# Altium schematic sheet MainBoard Pro Mini_2.SchDoc
size A4; SheetNumber: 2; SheetTotal: 2
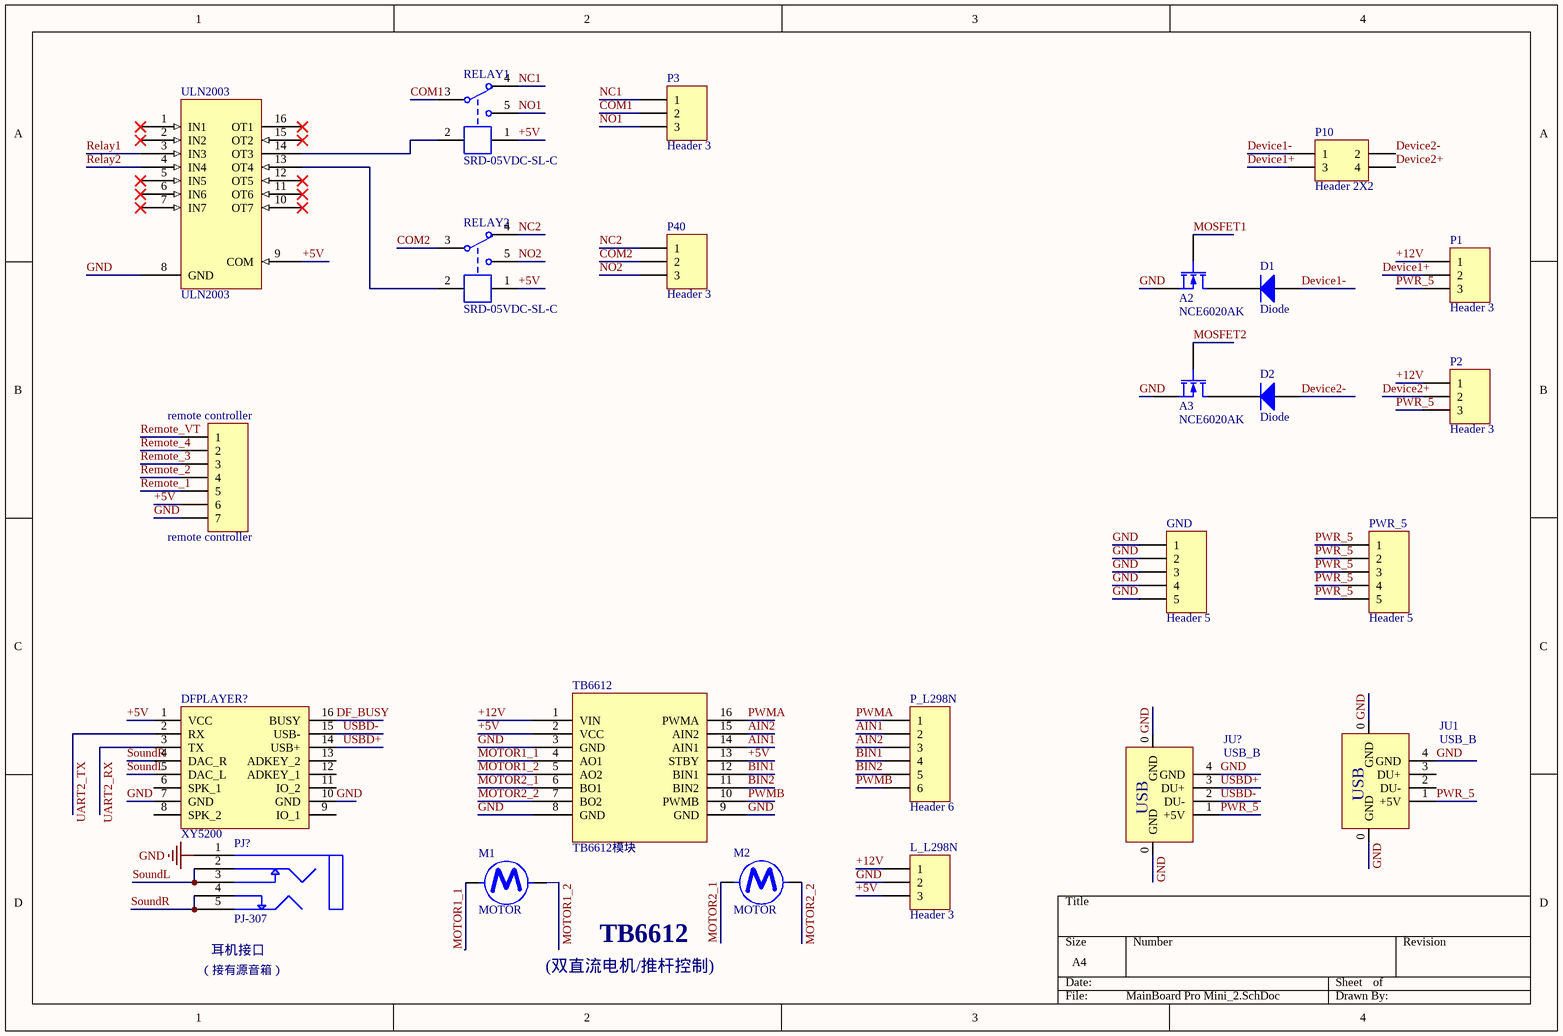
[diagram p0: MainBoard Pro Mini_2.SchDoc]

## Parts
A2  NCE6020AK  [TO252-2L]
A3  NCE6020AK  [TO252-2L]
D1  Diode  [DO-214AC]
D2  Diode  [DO-214AC]
DFPLAYER?  XY5200  [DFPlayer]
GND  Header 5  [HDR1X5]
JU1  USB_B  [USB-48204-0001]
JU?  USB_B  [USB-1734085]
L_L298N  Header 3  [PHOENIX_1715734]
M1  MOTOR  [KF2EDGK5.0-WI-2P]
M2  MOTOR  [KF2EDGK5.0-WI-2P]
P1  Header 3  [COMATEL_385.0358.1.03.400]
P2  Header 3  [COMATEL_385.0358.1.03.400]
P3  Header 3  [PHOENIX_1715734]
P10  Header 2X2  [CK-5.08-2x2]
P40  Header 3  [PHOENIX_1715734]
P_L298N  Header 6  [2-644861-6 _2.54]
PJ?  PJ-307  [PJ-307X]
PWR_5  Header 5  [HDR1X5]
RELAY1  SRD-05VDC-SL-C  [REL_FINDER_36.11]
RELAY2  SRD-05VDC-SL-C  [REL_FINDER_36.11]
remote_controller  remote controller  [HDR2.54-M-LI-7P]
TB6612  TB6612模块  [TB6612]
ULN2003  ULN2003  [SO-16 - 1.27]

## Nets
GND: A2.3(S) A3.3(S) DFPLAYER?.7(GND) DFPLAYER?.10(GND) GND.1 GND.2 GND.3 GND.4 GND.5 JU1.0(GND) JU1.4(GND) JU?.0(GND) JU?.4(GND) L_L298N.2 PJ?.1(L) remote_controller.7 TB6612.3(GND) TB6612.8(GND) TB6612.9(GND) ULN2003.8(GND)
+5V: DFPLAYER?.1(VCC) L_L298N.3 RELAY1.1 RELAY2.1 remote_controller.6 TB6612.2(VCC) TB6612.13(STBY) ULN2003.9(COM)
+12V: L_L298N.1 P1.1 P2.1 TB6612.1(VIN)
AIN1: P_L298N.2 TB6612.14(AIN1)
AIN2: P_L298N.3 TB6612.15(AIN2)
BIN1: P_L298N.4 TB6612.12(BIN1)
BIN2: P_L298N.5 TB6612.11(BIN2)
COM1: P3.2 RELAY1.3
COM2: P40.2 RELAY2.3
Device1+: P1.2 P10.3
Device1-: D1.1(A) P10.1
Device2+: P2.2 P10.4
Device2-: D2.1(A) P10.2
DF_BUSY: DFPLAYER?.16(BUSY)
MOSFET1: A2.2(G)
MOSFET2: A3.2(G)
MOTOR1_1: M1.1(A) TB6612.4(AO1)
MOTOR1_2: M1.2(B) TB6612.5(AO2)
MOTOR2_1: M2.1(A) TB6612.6(BO1)
MOTOR2_2: M2.2(B) TB6612.7(BO2)
NC1: P3.1 RELAY1.4
NC2: P40.1 RELAY2.4
NO1: P3.3 RELAY1.5
NO2: P40.3 RELAY2.5
PWMA: P_L298N.1 TB6612.16(PWMA)
PWMB: P_L298N.6 TB6612.10(PWMB)
PWR_5: JU1.1(+5V) JU?.1(+5V) P1.3 P2.3 PWR_5.1 PWR_5.2 PWR_5.3 PWR_5.4 PWR_5.5
Relay1: ULN2003.3(IN3)
Relay2: ULN2003.4(IN4)
Remote_1: remote_controller.5
Remote_2: remote_controller.4
Remote_3: remote_controller.3
Remote_4: remote_controller.2
Remote_VT: remote_controller.1
SoundL: DFPLAYER?.5(DAC_L) PJ?.2(L1) PJ?.3(R1)
SoundR: DFPLAYER?.4(DAC_R) PJ?.4(R) PJ?.5(COM)
UART2_RX: DFPLAYER?.3(TX)
UART2_TX: DFPLAYER?.2(RX)
USBD+: DFPLAYER?.14(USB+) JU?.3(DU+)
USBD-: DFPLAYER?.15(USB-) JU?.2(DU-)
NetA2_1: A2.1(D) D1.2(K)
NetA3_1: A3.1(D) D2.2(K)
NetRELAY1_2: RELAY1.2 ULN2003.14(OT3)
NetRELAY2_2: RELAY2.2 ULN2003.13(OT4)

Not connected (* = marked no-connect by the designer): DFPLAYER? 6(SPK_1) 8(SPK_2) 9(IO_1) 11(IO_2) 12(ADKEY_1) 13(ADKEY_2); JU1 2(DU-) 3(DU+); ULN2003 1(IN1)* 2(IN2)* 5(IN5)* 6(IN6)* 7(IN7)* 10(OT7)* 11(OT6)* 12(OT5)* 15(OT2)* 16(OT1)*

## Notes on the sheet
- （接有源音箱）
- (near PJ?) 耳机接口
- (双直流电机/推杆控制)
- TB6612
- (in symbol USB_B) USB

## Library data of the parts
A2 A3 = MOSFET-N: N-Channel MOSFET; Published: 8-Jun-2000; LatestRevisionDate: 17-Jul-2002; LatestRevisionNote: Re-released for DXP Platform.; PackageVersion: 1995/1996; PackageReference: E3; Publisher: Altium Limited; PackageDescription: TO, Flat Index; 3 In-Line, Axial Leads; Body Dia. 4.6mm; Lead Dia. 0.5 mm (max)
D1 D2 = Diode: Default Diode; Published: 8-Jun-2000; LatestRevisionDate: 17-Jul-2002; LatestRevisionNote: Re-released for DXP Platform.; PackageVersion: Sep-1996; PackageReference: SMC; Publisher: Altium Limited; PackageDescription: DO-214-AB/SMC; 2 C-Bend Leads; Body 7.9 x 5.9 mm, inc. leads (LxW); Code_JEDEC: DO-214-AB
DFPLAYER? = Mini MP3 Player: MP3模块; 版权归属: 封装库来自淘宝 ID：黄晶宝石; BOM名称: MP3模块; 学习资源: https://shop463601444.taobao.com
GND PWR_5 = Header 5: Header, 5-Pin; LatestRevisionDate: 17-Jul-2002; LatestRevisionNote: Re-released for DXP Platform.; Publisher: Altium Limited
L_L298N P1-P3 P40 = Header 3: Header, 3-Pin; LatestRevisionDate: 17-Jul-2002; LatestRevisionNote: Re-released for DXP Platform.; Publisher: Altium Limited
P10 = Header 2X2: Header, 2-Pin, Dual row; LatestRevisionDate: 17-Jul-2002; LatestRevisionNote: Re-released for DXP Platform.; Publisher: Altium Limited
P_L298N = Header 6: Header, 6-Pin; LatestRevisionDate: 17-Jul-2002; LatestRevisionNote: Re-released for DXP Platform.; Publisher: Altium Limited
PJ? = PJ-307: 立体声耳机插座
RELAY1 RELAY2 = SRD-05VDC-SL-C: 5V一组转换; BOM名称: 5V继电器; 版权归属: 封装库来自淘宝卖家 ID：黄晶宝石; 学习资源: https://shop463601444.taobao.com
remote_controller = Header 7: Header, 7-Pin; LatestRevisionDate: 17-Jul-2002; LatestRevisionNote: Re-released for DXP Platform.; Publisher: Altium Limited
TB6612 = TB6612
ULN2003 = ULN2003: 达林顿驱动芯片